# EAGLE design esp-8266-display (EAGLE 7.7.0)
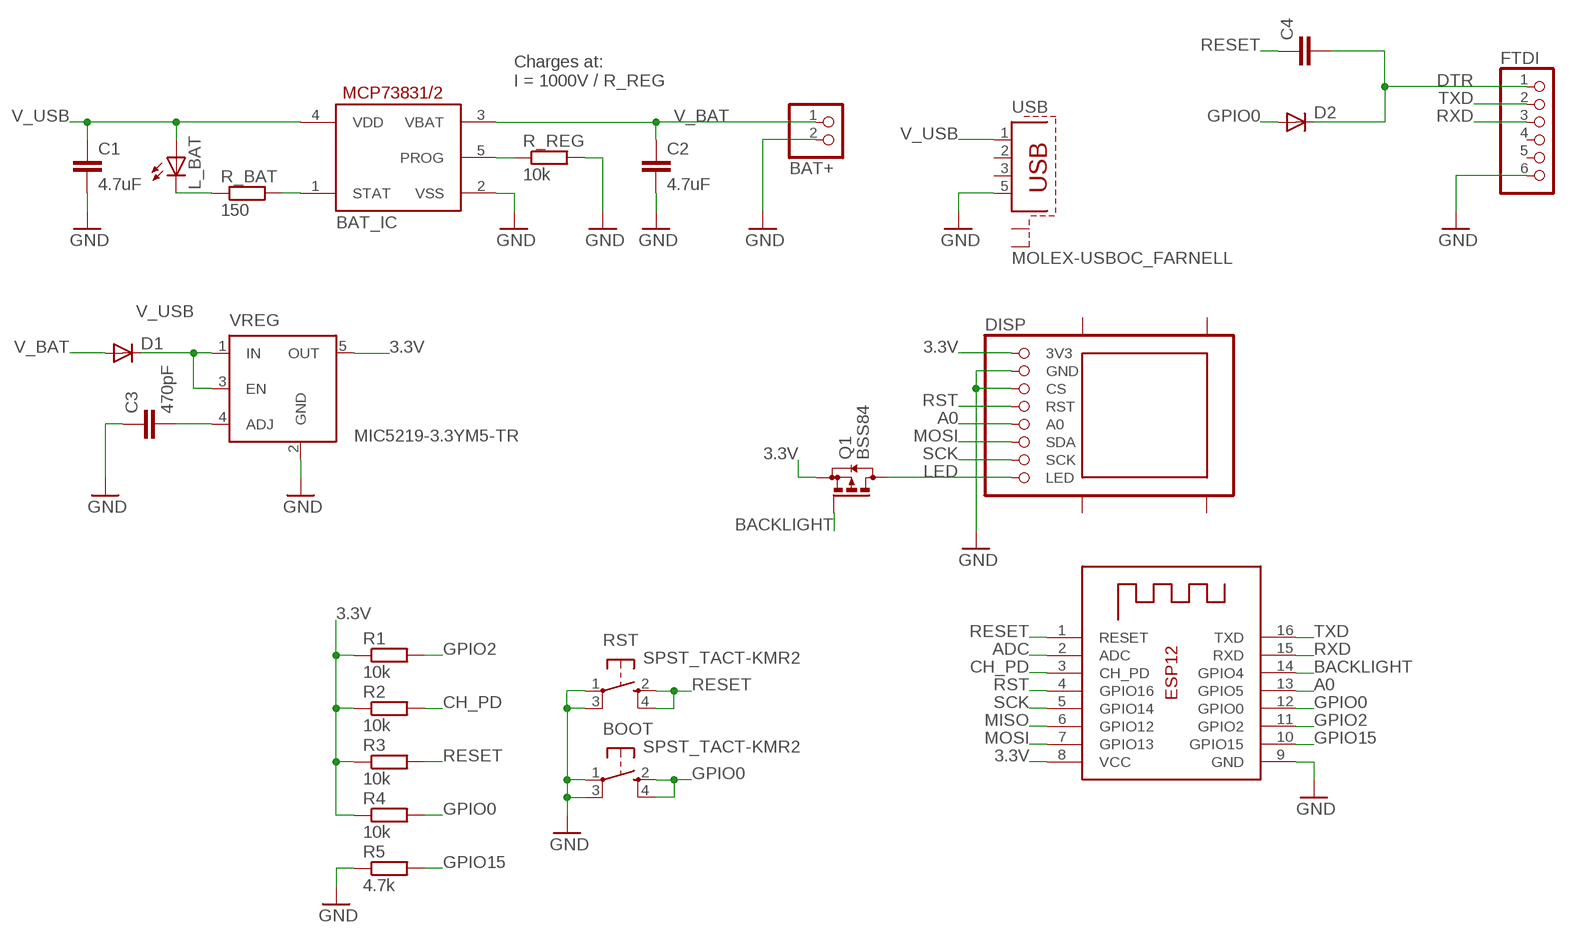
[diagram p0: schematic, sheet 1]

## Parts
BAT+  JST_2PIN-SMT-RA  [JST-PH-2-SMT-RA]
BAT_IC  MCP73831/OT  [SOT23-5L]
BOOT  SPST_TACT-KMR2  [KMR2]
C1  4.7uF  C-EUC0603  [C0603]
C2  4.7uF  C-EUC0603  [C0603]
C3  470pF  C-EUC0603  [C0603]
C4  C-EUC0603  [C0603]
D1  DIODE-SOD123  [SOD123]
D2  DIODE-SOD123  [SOD123]
DISP  TFT1.8  [TFT01-1.8SP]
FTDI  PINHD-1X6  [1X06]
L_BAT  LEDCHIPLED_0603  [CHIPLED_0603]
Q1  BSS84  [SOT23]
R1  10k  R-EU_R0603  [R0603]
R2  10k  R-EU_R0603  [R0603]
R3  10k  R-EU_R0603  [R0603]
R4  10k  R-EU_R0603  [R0603]
R5  4.7k  R-EU_R0603  [R0603]
R_BAT  150  R-EU_R0603  [R0603]
R_REG  10k  R-EU_R0603  [R0603]
RST  SPST_TACT-KMR2  [KMR2]
USB  MOLEX-USBOC_FARNELL  [MOLEX-105017]
VREG  MIC5219-3.3YM5-TR  MIC5219BM5  [SOT23-5]
X1  ESP-12  [ESP-12]

## Nets
3.3V: DISP.VCC(3V3) Q1.2(S) R1.1 R2.1 R3.1 R4.1 VREG.5(OUT) X1.8(VCC)
A0: DISP.A0 X1.13(GPIO5)
ADC: X1.2(ADC)
BACKLIGHT: Q1.1(G) X1.14(GPIO4)
CH_PD: R2.2 X1.3(CH_PD)
DTR: C4.2 D2.C FTDI.1
GND [power]: BAT+.2 BAT_IC.2(VSS) BOOT.1(P) BOOT.3(P1) C1.2 C2.2 C3.1 DISP.CS DISP.GND FTDI.6 R5.1 R_REG.2 RST.1(P) RST.3(P1) USB.5 VREG.2(GND) X1.9(GND)
GPIO0: BOOT.2(S) BOOT.4(S1) D2.A R4.2 X1.12(GPIO0)
GPIO2: R1.2 X1.11(GPIO2)
GPIO15: R5.2 X1.10(GPIO15)
LED: DISP.LED Q1.3(D)
MISO: X1.6(GPIO12)
MOSI: DISP.SDA X1.7(GPIO13)
N$4: BAT_IC.1(STAT) R_BAT.2
N$5: L_BAT.C R_BAT.1
N$6: C3.2 VREG.4(ADJ)
N$7: BAT_IC.5(PROG) R_REG.1
RESET: C4.1 R3.2 RST.2(S) RST.4(S1) X1.1(RESET)
RST: DISP.RST X1.4(GPIO16)
RXD: FTDI.3 X1.15(RXD)
SCK: DISP.SCK X1.5(GPIO14)
TXD: FTDI.2 X1.16(TXD)
V_BAT [power]: BAT+.1 BAT_IC.3(VBAT) C2.1 D1.A
V_USB [power]: BAT_IC.4(VDD) C1.1 D1.C L_BAT.A USB.1 VREG.1(IN) VREG.3(EN)
Unconnected: DISP.DRILL$1(DRILL) DISP.DRILL$2(DRILL) DISP.DRILL$3(DRILL) DISP.DRILL$4(DRILL) FTDI.4 FTDI.5 USB.2 USB.3 USB.GND@1(S1) USB.GND@2(S1) USB.SHD@1(S2) USB.SHD@2(S2) USB.SHD@3(S2) USB.SHD@4(S2) USB.SHD@5(S2) USB.SHD@6(S2)

## Notes on the sheet
- Charges at:
  I = 1000V / R_REG

## Library data of the parts
BAT+ = adafruit:JST_2PIN: JST 2-Pin Connectors of various flavors SMT-RA (S2B-PH-SM4) 4UConnector #17311 SMT (B2B-PH-SM4) THM-RA (S2B-PH) THM (B2B-PH); OC_FARNELL: 9492615
BAT_IC = adafruit:MCP73831: MCP73831/2 Miniature Single-Cell, Fully Integrated Li-Ion, Li-Polymer Charge Management Controllers. Nice and small simple lipoly charge controller, with adjustable current and status output (LED) http://www.ladyada.net/library/pcb/eaglelibrary.html; OC_FARNELL: 1840935
BOOT RST = adafruit:SPST_TACT: SMT 6mm switch, EVQQ2 series http://www.ladyada.net/library/eagle; OC_FARNELL: 1437635
C1 C2 = resistor:C-EU: CAPACITOR, European symbol; OC_FARNELL: 2320818
C3 = resistor:C-EU: CAPACITOR, European symbol; OC_FARNELL: 1856090
C4 = resistor:C-EU: CAPACITOR, European symbol
D1 D2 = diode:DIODE-: DIODE; OC_FARNELL: 2533224
DISP = Maxis Library:TFT1.8
FTDI = pinhead:PINHD-1X6: PIN HEADER
L_BAT = adafruit:LED: LED OSRAM: - CHIPLED LG R971, LG N971, LY N971, LG Q971, LY Q971, LO R971, LY R971 LH N974, LH R974 LS Q976, LO Q976, LY Q976 LO Q996 - Hyper CHIPLED LW Q18S LB Q993, LB Q99A, LB R99A - SideLED LS A670, LO A670, LY A670, LG A670, LP A670 LB A673, LV A673, LT A673, LW A673 LH A674 LY A675 LS A676, LA A676, LO A676, LY A676, LW A676 LS A679, LY A679, LG A679 - Hyper Micro SIDELED® LS Y876, LA Y876, LO Y876, LY Y876 LT Y87S - SmartLED LW L88C, LW L88S LB L89C, LB L89S, LG L890 LS L89K, LO L89K, LY L89K LS L896, LA L896, LO L896, LY L896 - TOPLED LS T670, LO T670, LY T670, LG T670, LP T670 LSG T670, LSP T670, LSY T670, LOP T670, LYG T670 LG T671, LOG T671, LSG T671 LB T673, LV T673, LT T673, LW T673 LH T674 LS T676, LA T676, LO T676, LY T676, LB T676, LH T676, LSB T676, LW T676 LB T67C, LV T67C, LT T67C, LS T67K, LO T67K, LY T67K, LW E67C LS E67B, LA E67B, LO E67B, LY E67B, LB E67C, LV E67C, LT E67C LW T67C LS T679, LY T679, LG T679 LS T770, LO T770, LY T770, LG T770, LP T770 LB T773, LV T773, LT T773, LW T773 LH T774 LS E675, LA E675, LY E675, LS T675 LS T776, LA T776, LO T776, LY T776, LB T776 LHGB T686 LT T68C, LB T68C - Hyper Mini TOPLED® LB M676 - Mini TOPLED Santana® LG M470 LS M47K, LO M47K, LY M47K Source: http://www.osram.convergy.de/; OC_FARNELL: 2426215
Q1 = transistor-small-signal:BSS84: P-CHANNEL MOS FET; OC_FARNELL: 2396090
R1-R4 R_REG = resistor:R-EU_: RESISTOR, European symbol; OC_FARNELL: 9330399
R5 = resistor:R-EU_: RESISTOR, European symbol; OC_FARNELL: 2073509
R_BAT = resistor:R-EU_: RESISTOR, European symbol; OC_FARNELL: 9330593
USB = Maxis Library:MOLEX-USB; OC_FARNELL: 2293836
VREG = v-reg-micrel:MIC5219BM5: VOLTAGE REGULATOR; MF: ALTERA CORPORATION; MPN: MIC5219BM5 TR; OC_FARNELL: 2510252; OC_NEWARK: 09J8939
X1 = adafruit:ESP-12

## Net classes
0 default: width 0.254 mm, clearance 0.254 mm
1 power: width 0.406 mm, clearance 0.254 mm

## Board
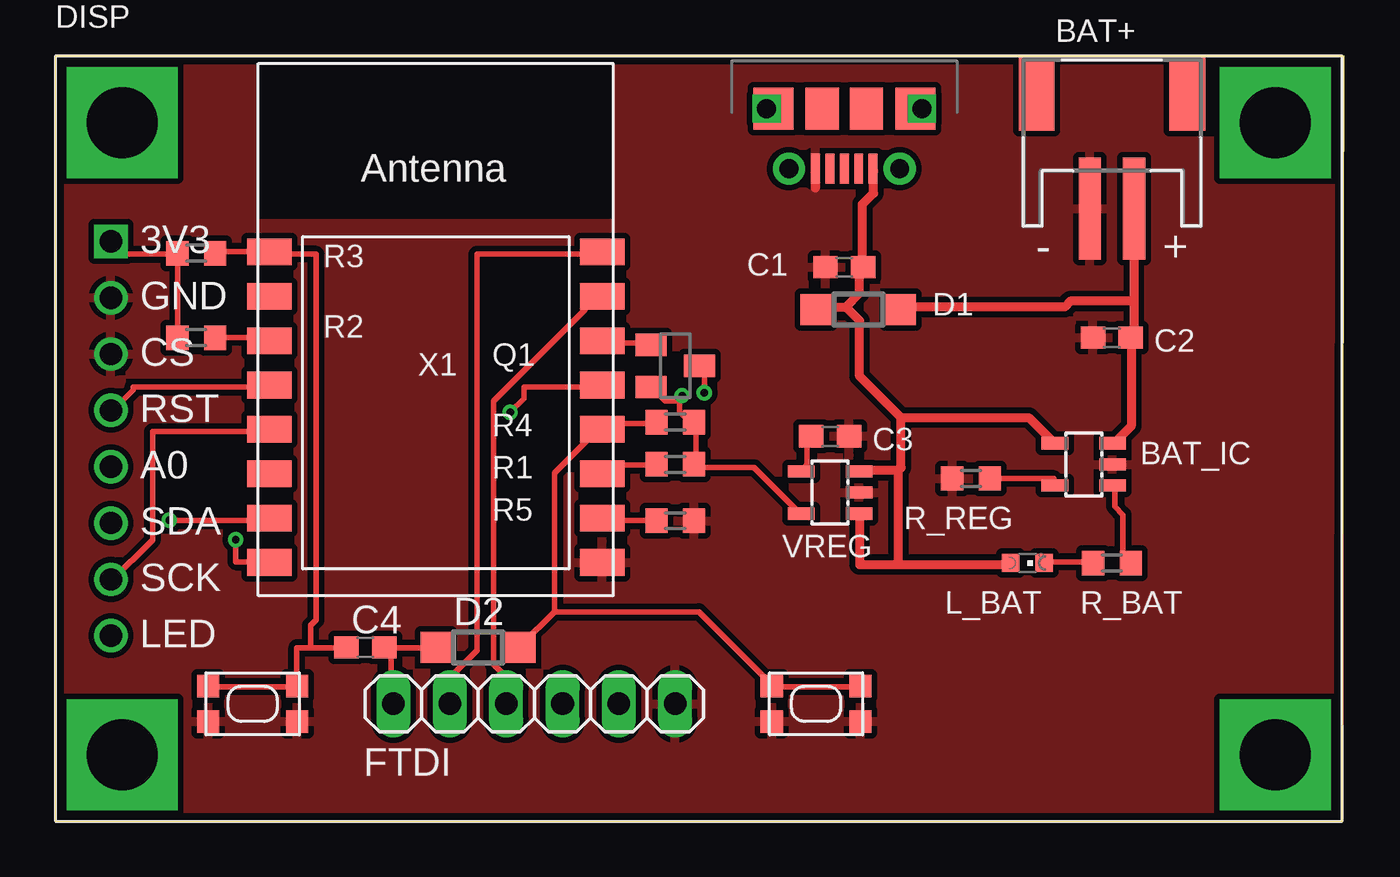
[diagram p1: board, top side]
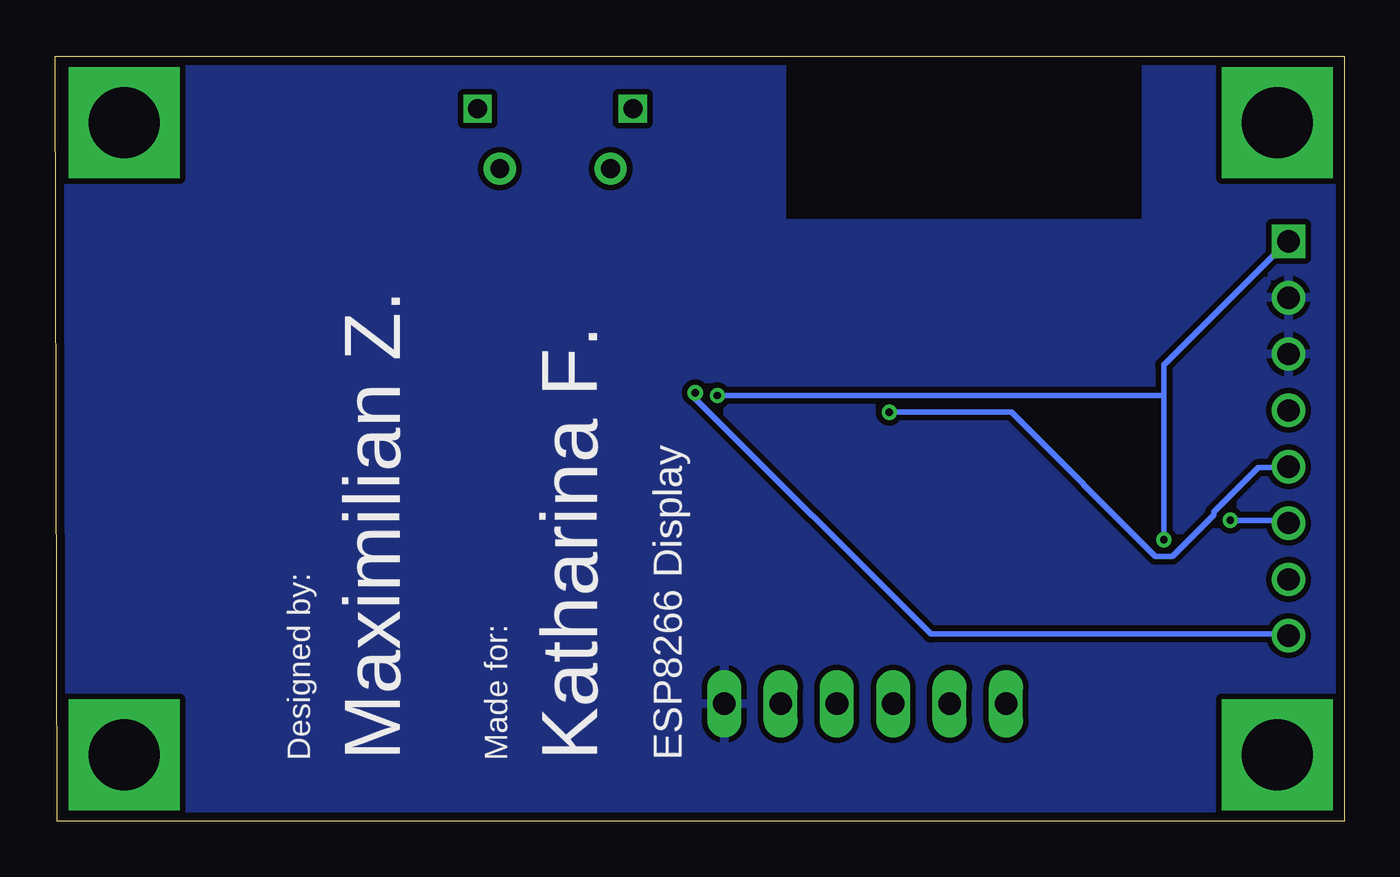
[diagram p2: board, bottom side, seen from below]

Size 58.09 x 34.5 mm. Coordinates in mm from the lower left corner, seen from the top.
Outline: 0,34.5 0,0 58,0 58.09,34.5 0,34.5
Copper layers (1*16): Top 0.0356mm / dielectric 1.5011mm / Bottom 0.0356mm
Design rules "OshPark Design Rules": minimum track width 6mil, minimum drill 13mil, track to track 6mil, track to pad 6mil, pad to pad 6mil, via to via 6mil, smd to smd 6mil, copper to edge 15mil, drill to drill 6mil, minimum pad ring 7mil, minimum via ring 7mil, stop-mask expansion 3mil, vias tented up to drill 0mil, thermal gap 10mil

### Footprints (pad centres in the part's own frame; a part is rotated, then mirrored left to right if it is on the bottom)
JST-PH-2-SMT-RA = smd 1 x 4.6: 1 1,-3.7; 2 -1,-3.7 | smd 1.6 x 3.4: NC1 -3.4,1.5; NC2 3.4,1.5
SOT23-5L = smd 0.55 x 1.2: 1 -0.95,-1.3; 2 0,-1.3; 3 0.95,-1.3; 4 0.95,1.3; 5 -0.95,1.3
KMR2 = smd 1 x 1: 1 2,0.8; 2 2,-0.8; 3 -2,0.8; 4 -2,-0.8
C0603 = smd 1.1 x 1: 1 -0.85,0; 2 0.85,0
SOD123 = smd 1.4 x 1.4: A 1.9,0; C -1.9,0
TFT01-1.8SP = drill 1: A0 18.52,2.5; CS 13.44,2.5; GND 10.9,2.5; LED 26.14,2.5; RST 15.98,2.5; SCK 23.6,2.5; SDA 21.06,2.5 | drill 3.2 pad 5 square: DRILL$1 3,55; DRILL$2 31.5,55; DRILL$3 31.5,3; DRILL$4 3,3 | drill 1 square: VCC 8.36,2.5
1X06 = drill 1.016 long: 1 -6.35,0; 2 -3.81,0; 3 -1.27,0; 4 1.27,0; 5 3.81,0; 6 6.35,0
CHIPLED_0603 = smd 0.8 x 0.8: A 0,-0.75; C 0,0.75
SOT23 = smd 1 x 1.4: 1 -0.95,-1.1; 2 0.95,-1.1; 3 0,1.1
R0603 = smd 1 x 1.1: 1 -0.85,0; 2 0.85,0
MOLEX-105017 = smd 0.4 x 1.35: 1 -1.3,0; 2 -0.65,0; 3 0,0; 4 0.65,0; 5 1.3,0 | drill 0.85 pad 1.45: GND@1 -2.5,0; GND@2 2.5,0 | drill 0.85 pad 1.2 square: SHD@1 -3.5,-2.7; SHD@2 3.5,-2.7 | smd 1.8 x 1.9: SHD@3 -3.2,-2.7; SHD@6 3.2,-2.7 | smd 1.5 x 1.9: SHD@4 -1,-2.7; SHD@5 1,-2.7
SOT23-5 = smd 0.55 x 1.2: 1 -0.95,-1.3; 2 0,-1.3; 3 0.95,-1.3; 4 0.95,1.3; 5 -0.95,1.3
ESP-12 = smd 2 x 1.2: 1 -7.5,4.5; 2 -7.5,2.5; 3 -7.5,0.5; 4 -7.5,-1.5; 5 -7.5,-3.5; 6 -7.5,-5.5; 7 -7.5,-7.5; 8 -7.5,-9.5; 9 7.5,-9.5; 10 7.5,-7.5; 11 7.5,-5.5; 12 7.5,-3.5; 13 7.5,-1.5; 14 7.5,0.5; 15 7.5,2.5; 16 7.5,4.5

### Placement (x,y rotation side)
BAT+  47.62,31.32 0 top
BAT_IC  46.35,16.09 90 top
BOOT  34.29,5.29 180 top
C1  35.56,24.98 180 top
C2  47.62,21.8 180 top
C3  34.92,17.36 180 top
C4  13.97,7.83 0 top
D1  36.2,23.07 0 top
D2  19.05,7.83 0 top
DISP  0,34.5 270 top
FTDI  21.59,5.29 0 top
L_BAT  43.81,11.64 270 top
Q1  27.94,20.53 270 top
R1  27.94,16.09 180 top
R2  6.35,21.8 0 top
R3  6.35,25.61 0 top
R4  27.94,17.99 180 top
R5  27.94,13.54 180 top
R_BAT  47.62,11.64 0 top
R_REG  41.27,15.45 180 top
RST  8.89,5.29 180 top
USB  35.56,29.42 180 top
VREG  34.92,14.81 90 top
X1  17.14,21.17 0 top

### Tracks (layer width: path | path; a pad name or v marks a point on that pad's centre or on a via)
3.3V  (via drill 0.33)
  Top 0.254: VREG.5 33.5,13.94 31.5,15.94 28.88,15.94 28.88,16.07 R1.1 28.88,16.19 28.88,17.94 R4.1 28.75,17.82 28.12,18.44 28.12,18.94 | 28.12,18.94 27.5,18.94 26.88,19.57 Q1.2 | R2.1 R3.1 5.38,25.57 2.5,25.57 DISP.VCC | v8.12,12.69 8.12,11.69 9.62,11.69 X1.8 | v28.25,19.19 28.12,19.07 28.12,18.94
  Bottom 0.254: 8.12,19.19 8.12,20.57 2.5,26.19 DISP.VCC | 8.12,19.19 v8.12,12.69 | 8.12,19.19 v28.25,19.19
A0  (via drill 0.33)
  Top 0.254: v20.5,18.44 21.12,19.07 21.12,19.57 24.62,19.57 X1.13
  Bottom 0.254: v20.5,18.44 15,18.44 8.5,11.94 7.75,11.94 5.88,13.81 5.88,13.94 3.88,15.94 2.5,15.94 DISP.A0
BACKLIGHT
  Top 0.254: Q1.1 26.75,21.57 24.75,21.57 X1.14
CH_PD
  Top 0.254: R2.2 7.25,21.82 9.62,21.82 9.62,21.69 X1.3
DTR
  Top 0.254: FTDI.1 15.12,5.31 15.12,7.56 14.88,7.81 C4.2 15,7.81 17.12,7.81 D2.C
GND
  Top 0.406: USB.5 34.25,29.32 34.25,28.69 34.26,28.55
  pour Top: -2.54,37.04 60.96,37.04 60.96,-2.33 -2.54,-2.33
  pour Bottom: -1.27,34.5 -1.27,35.77 59.69,35.77 59.69,-1.06 -1.27,-1.06
GPIO0
  Top 0.254: BOOT.4 36.25,6.06 32.38,6.06 BOOT.2 32.25,6.19 29,9.44 22.5,9.44 | R4.2 27,17.94 24.75,17.94 24.75,17.69 X1.12 24.62,17.82 22.5,15.69 22.5,9.44 | 22.5,9.44 21,7.94 D2.A
GPIO2
  Top 0.254: R1.2 27,16.07 24.75,16.07 24.75,15.69 X1.11
GPIO15
  Top 0.254: R5.2 27,13.56 24.75,13.56 X1.10
LED  (via drill 0.33)
  Top 0.254: v29.25,19.32 29.25,20.32 29.12,20.44 Q1.3
  Bottom 0.254: v29.25,19.32 29.25,19.07 18.62,8.44 2.5,8.44 DISP.LED
MOSI  (via drill 0.33)
  Top 0.254: v5.12,13.56 9.62,13.56 X1.7
  Bottom 0.254: v5.12,13.56 2.62,13.56 DISP.SDA
N$4
  Top 0.254: R_BAT.2 48.38,11.69 48.12,11.94 48.12,13.81 47.75,14.19 47.75,15.06 BAT_IC.1
N$5
  Top 0.254: L_BAT.C 44.62,11.69 46.75,11.69 R_BAT.1
N$6
  Top 0.254: C3.2 34,17.32 33.88,17.19 33.88,16.07 33.62,15.81 VREG.4
N$7
  Top 0.254: R_REG.1 45,15.44 45,15.19 BAT_IC.5
RESET
  Top 0.254: R3.2 7.25,25.69 9.62,25.69 X1.1 9.75,25.57 11.75,25.57 11.75,9.06 11.5,8.81 11.5,7.81 | RST.2 7,6.06 10.88,6.06 RST.4 10.88,6.19 10.88,7.81 11.5,7.81 | 11.5,7.81 13,7.81 C4.1
RST
  Top 0.254: X1.4 9.62,19.57 3.5,19.57 3.5,19.44 2.5,18.44 DISP.RST
RXD
  Top 0.254: X1.15 24.62,23.57 23.88,23.57 23.88,23.07 19.75,18.94 19.75,7.06 20.25,6.56 20.25,5.31 FTDI.3
SCK
  Top 0.254: X1.5 9.62,17.57 4.38,17.57 4.38,12.69 2.5,10.81 DISP.SCK
TXD
  Top 0.254: X1.16 24.62,25.57 19,25.57 19,7.69 17.88,6.56 17.88,5.31 FTDI.2
V_BAT
  Top 0.406: BAT+.1 48.62,23.44 | 48.62,23.44 48.62,21.94 48.5,21.82 C2.1 48.5,21.69 48.5,17.82 47.75,17.07 BAT_IC.3 | 48.62,23.44 45.75,23.44 45.5,23.19 38.12,23.19 D1.A
V_USB
  Top 0.406: 35.62,23.19 36.25,23.82 36.25,24.82 C1.1 36.38,25.07 36.38,27.82 36.88,28.32 36.88,29.32 USB.1 | 35.62,23.19 34.38,23.19 D1.C | 38,11.56 36.25,11.56 36.25,13.81 VREG.1 | 38,11.56 43,11.56 L_BAT.A | 38,15.81 36.25,15.81 VREG.3 | 38,11.56 38,15.81 | 38.12,18.19 43.88,18.19 45,17.07 BAT_IC.4 | 38.12,18.19 38.12,15.94 38,15.81 | 35.62,23.19 36.25,22.57 36.25,20.07 38.12,18.19

### Text on the board
bNames: ESP8266 Display | Katharina F. | Made for: | Maximilian Z. | Designed by: